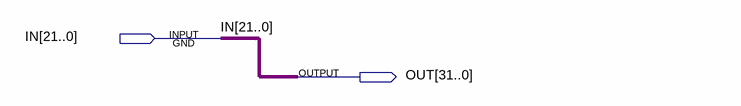
[diagram p0: schematic sheet]
// Quartus schematic signext22_32.bdf as structural Verilog: 0 symbols, 2 pins
module signext22_32 (
  input  [21:0] IN,
  output [31:0] OUT
);


  assign OUT = {{11{IN[21]}}, IN[20:0]};
endmodule
